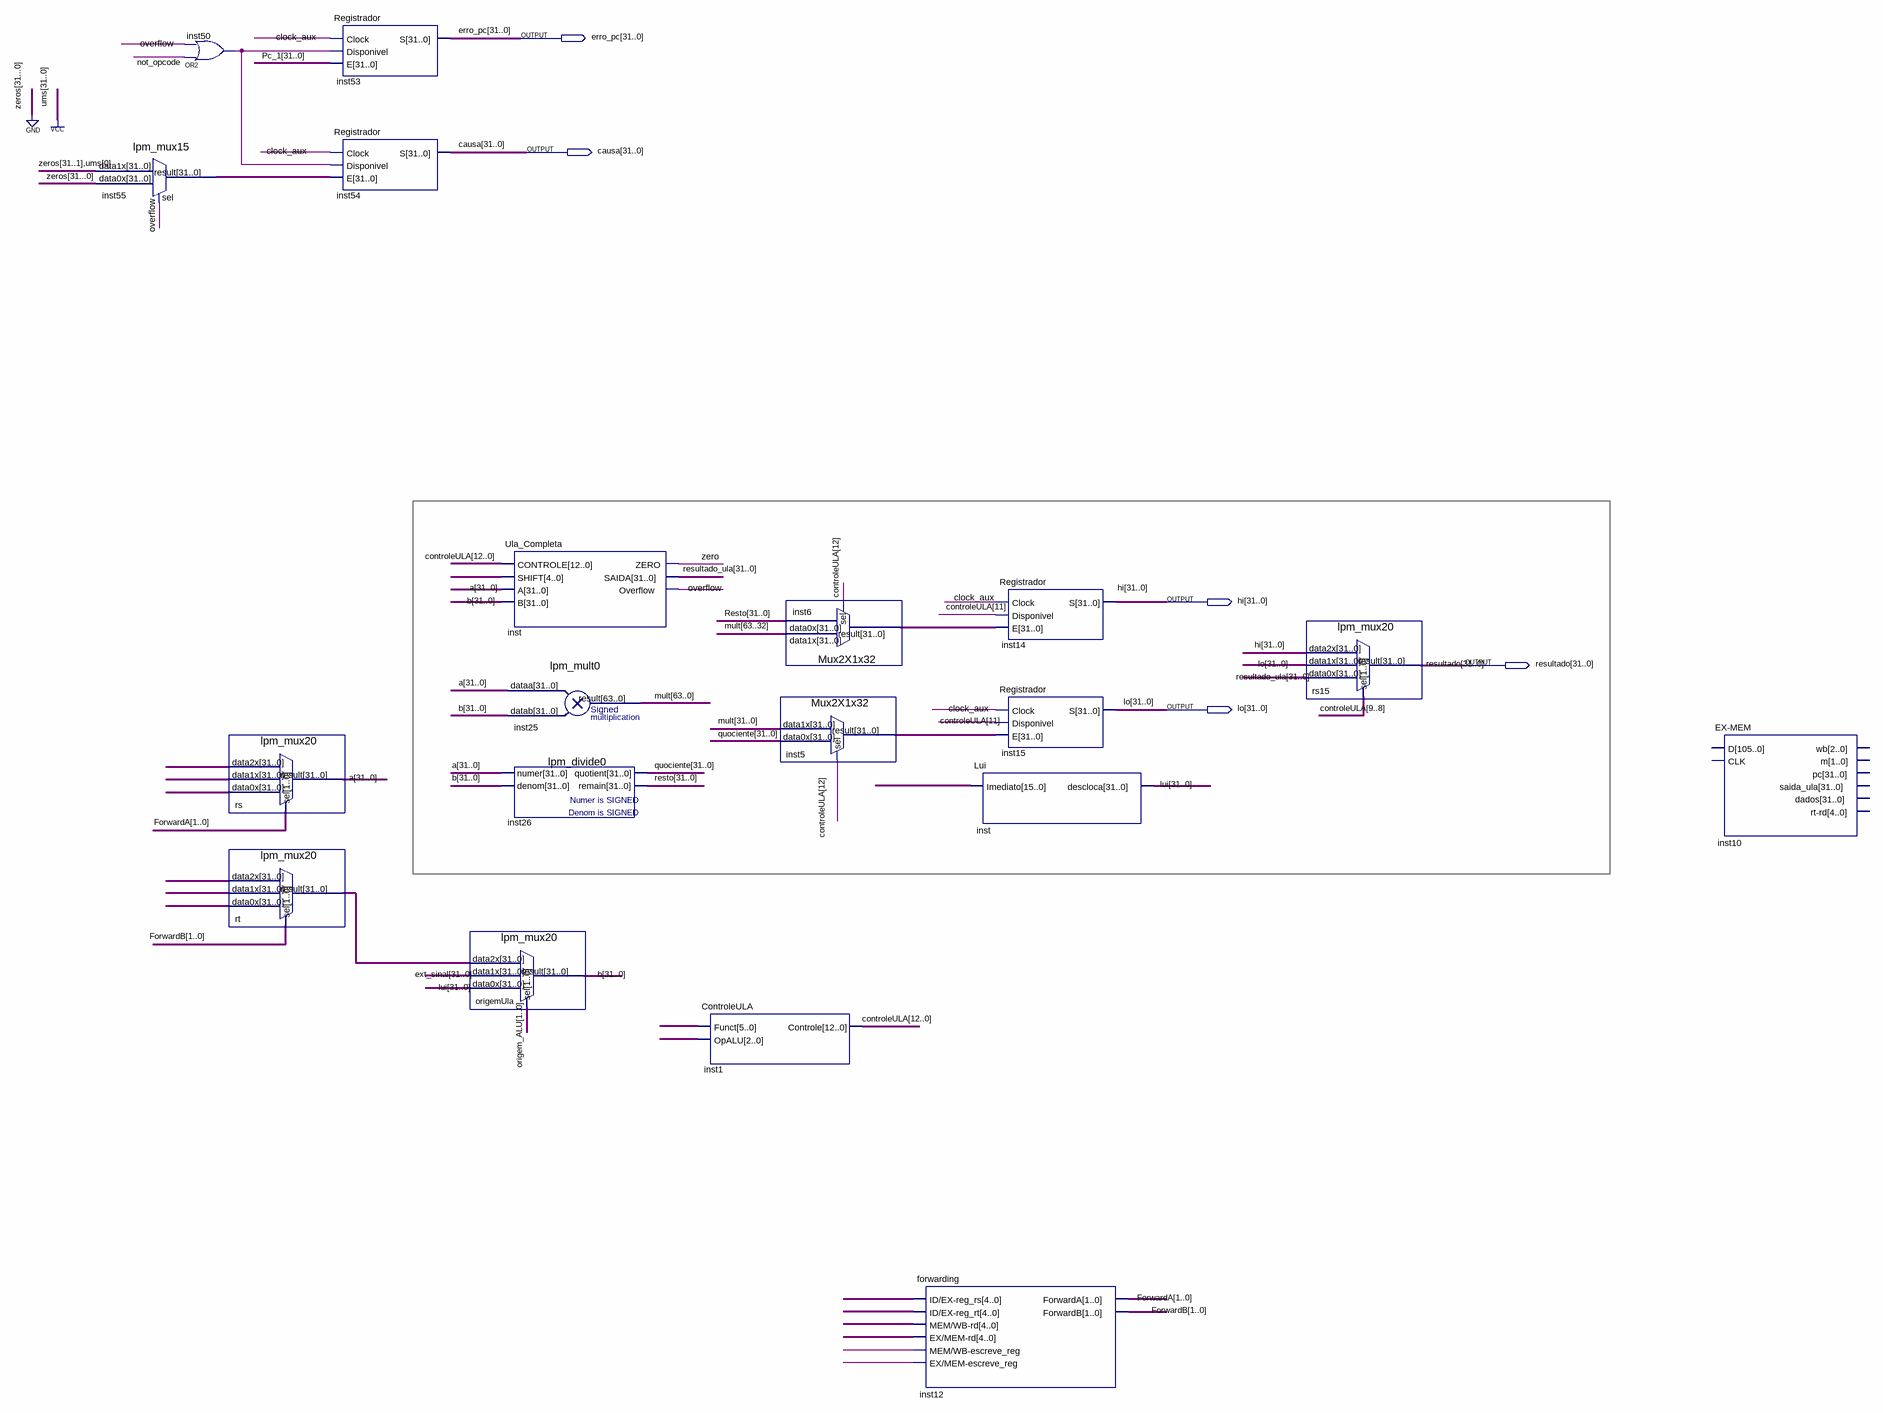
[diagram p0: schematic sheet]
// Quartus schematic exe.bdf as structural Verilog: 19 symbols, 5 pins
module exe (
  output [31:0] erro_pc,
  output [31:0] causa,
  output [31:0] hi,
  output [31:0] resultado,
  output [31:0] lo
);

  wire clock_aux, inst50_out, not_opcode, overflow, undriven_15, undriven_16, zero;
  wire [1:0] ForwardA, ForwardB, origem_ALU;
  wire [2:0] undriven_10;
  wire [4:0] undriven, undriven_11, undriven_12, undriven_13, undriven_14;
  wire [5:0] undriven_9;
  wire [12:0] controleULA;
  wire [15:0] undriven_2;
  wire [31:0] a, b, ext_sinal, inst5_result, inst6_result, inst55_result, lui, Pc_1, quociente, resto,
       resultado_ula, rt_result, undriven_3, undriven_4, undriven_5, undriven_6, undriven_7, undriven_8;
  wire [31:1] zeros;
  wire [63:0] mult;

  lpm_mux15 inst55 (.data1x({zeros, 1'b1}), .data0x({32{1'b0}}), .sel(overflow), .result(inst55_result));
  or inst50 (inst50_out, not_opcode, overflow);
  lpm_mux20 rs (.data2x(undriven_6), .data1x(undriven_7), .data0x(undriven_8), .sel(ForwardA), .result(a));
  lpm_mux20 rt (.data2x(undriven_5), .data1x(undriven_3), .data0x(undriven_4), .sel(ForwardB), .result(rt_result));
  Registrador inst53 (.Clock(clock_aux), .Disponivel(inst50_out), .E(Pc_1), .S(erro_pc));
  Registrador inst54 (.Clock(clock_aux), .Disponivel(inst50_out), .E(inst55_result), .S(causa));
  lpm_mux20 origemUla (.data2x(rt_result), .data1x(ext_sinal), .data0x(lui), .sel(origem_ALU), .result(b));
  Ula_Completa inst (
    .CONTROLE(controleULA), .SHIFT(undriven), .A(a), .B(b), .ZERO(zero), .SAIDA(resultado_ula),
    .Overflow(overflow));
  lpm_mult0 inst25 (.dataa(a), .datab(b), .result(mult));
  lpm_divide0 inst26 (.numer(a), .denom(b), .quotient(quociente), .remain(resto));
  ControleULA inst1 (.Funct(undriven_9), .OpALU(undriven_10), .Controle(controleULA));
  Mux2X1x32 inst6 (.data1x(mult[63:32]), .data0x(resto), .sel(controleULA[12]), .result(inst6_result));
  Mux2X1x32 inst5 (.data1x(mult[31:0]), .data0x(quociente), .sel(controleULA[12]), .result(inst5_result));
  forwarding inst12 (
    .\ID/EX-reg_rs (undriven_12), .\ID/EX-reg_rt (undriven_11), .\MEM/WB-rd (undriven_13),
    .\EX/MEM-rd (undriven_14), .\MEM/WB-escreve_reg (undriven_15), .\EX/MEM-escreve_reg (undriven_16),
    .ForwardA(ForwardA), .ForwardB(ForwardB));
  Lui inst_dup2 (.Imediato(undriven_2), .descloca(lui));
  Registrador inst14 (.Clock(clock_aux), .Disponivel(controleULA[11]), .E(inst6_result), .S(hi));
  Registrador inst15 (.Clock(clock_aux), .Disponivel(controleULA[11]), .E(inst5_result), .S(lo));
  lpm_mux20 rs15 (.data2x(hi), .data1x(lo), .data0x(resultado_ula), .sel(controleULA[9:8]), .result(resultado));
  \EX-MEM  inst10 ();  // open: D, CLK, wb, m, pc, saida_ula, dados, rt-rd
endmodule
